# Altium schematic sheet 08_Fan Debug and EEPROM.SchDoc: C200
size 439 x 311 mm; Page Create Date: March  8, 1995; Page Number: 8; Page Size: Custom; Comment: radxa_1010; Page Count: 21; RevCode: V1.11; Doc: 08_Fan Debug and EEPROM; DsnPath: D:\WMS\C200\CC122\对外\C200 V1.11.DSN; SchematicName: c200; PageName: 08_Fan Debug and EEPROM; PageSize: Custom; TopSchematic: True
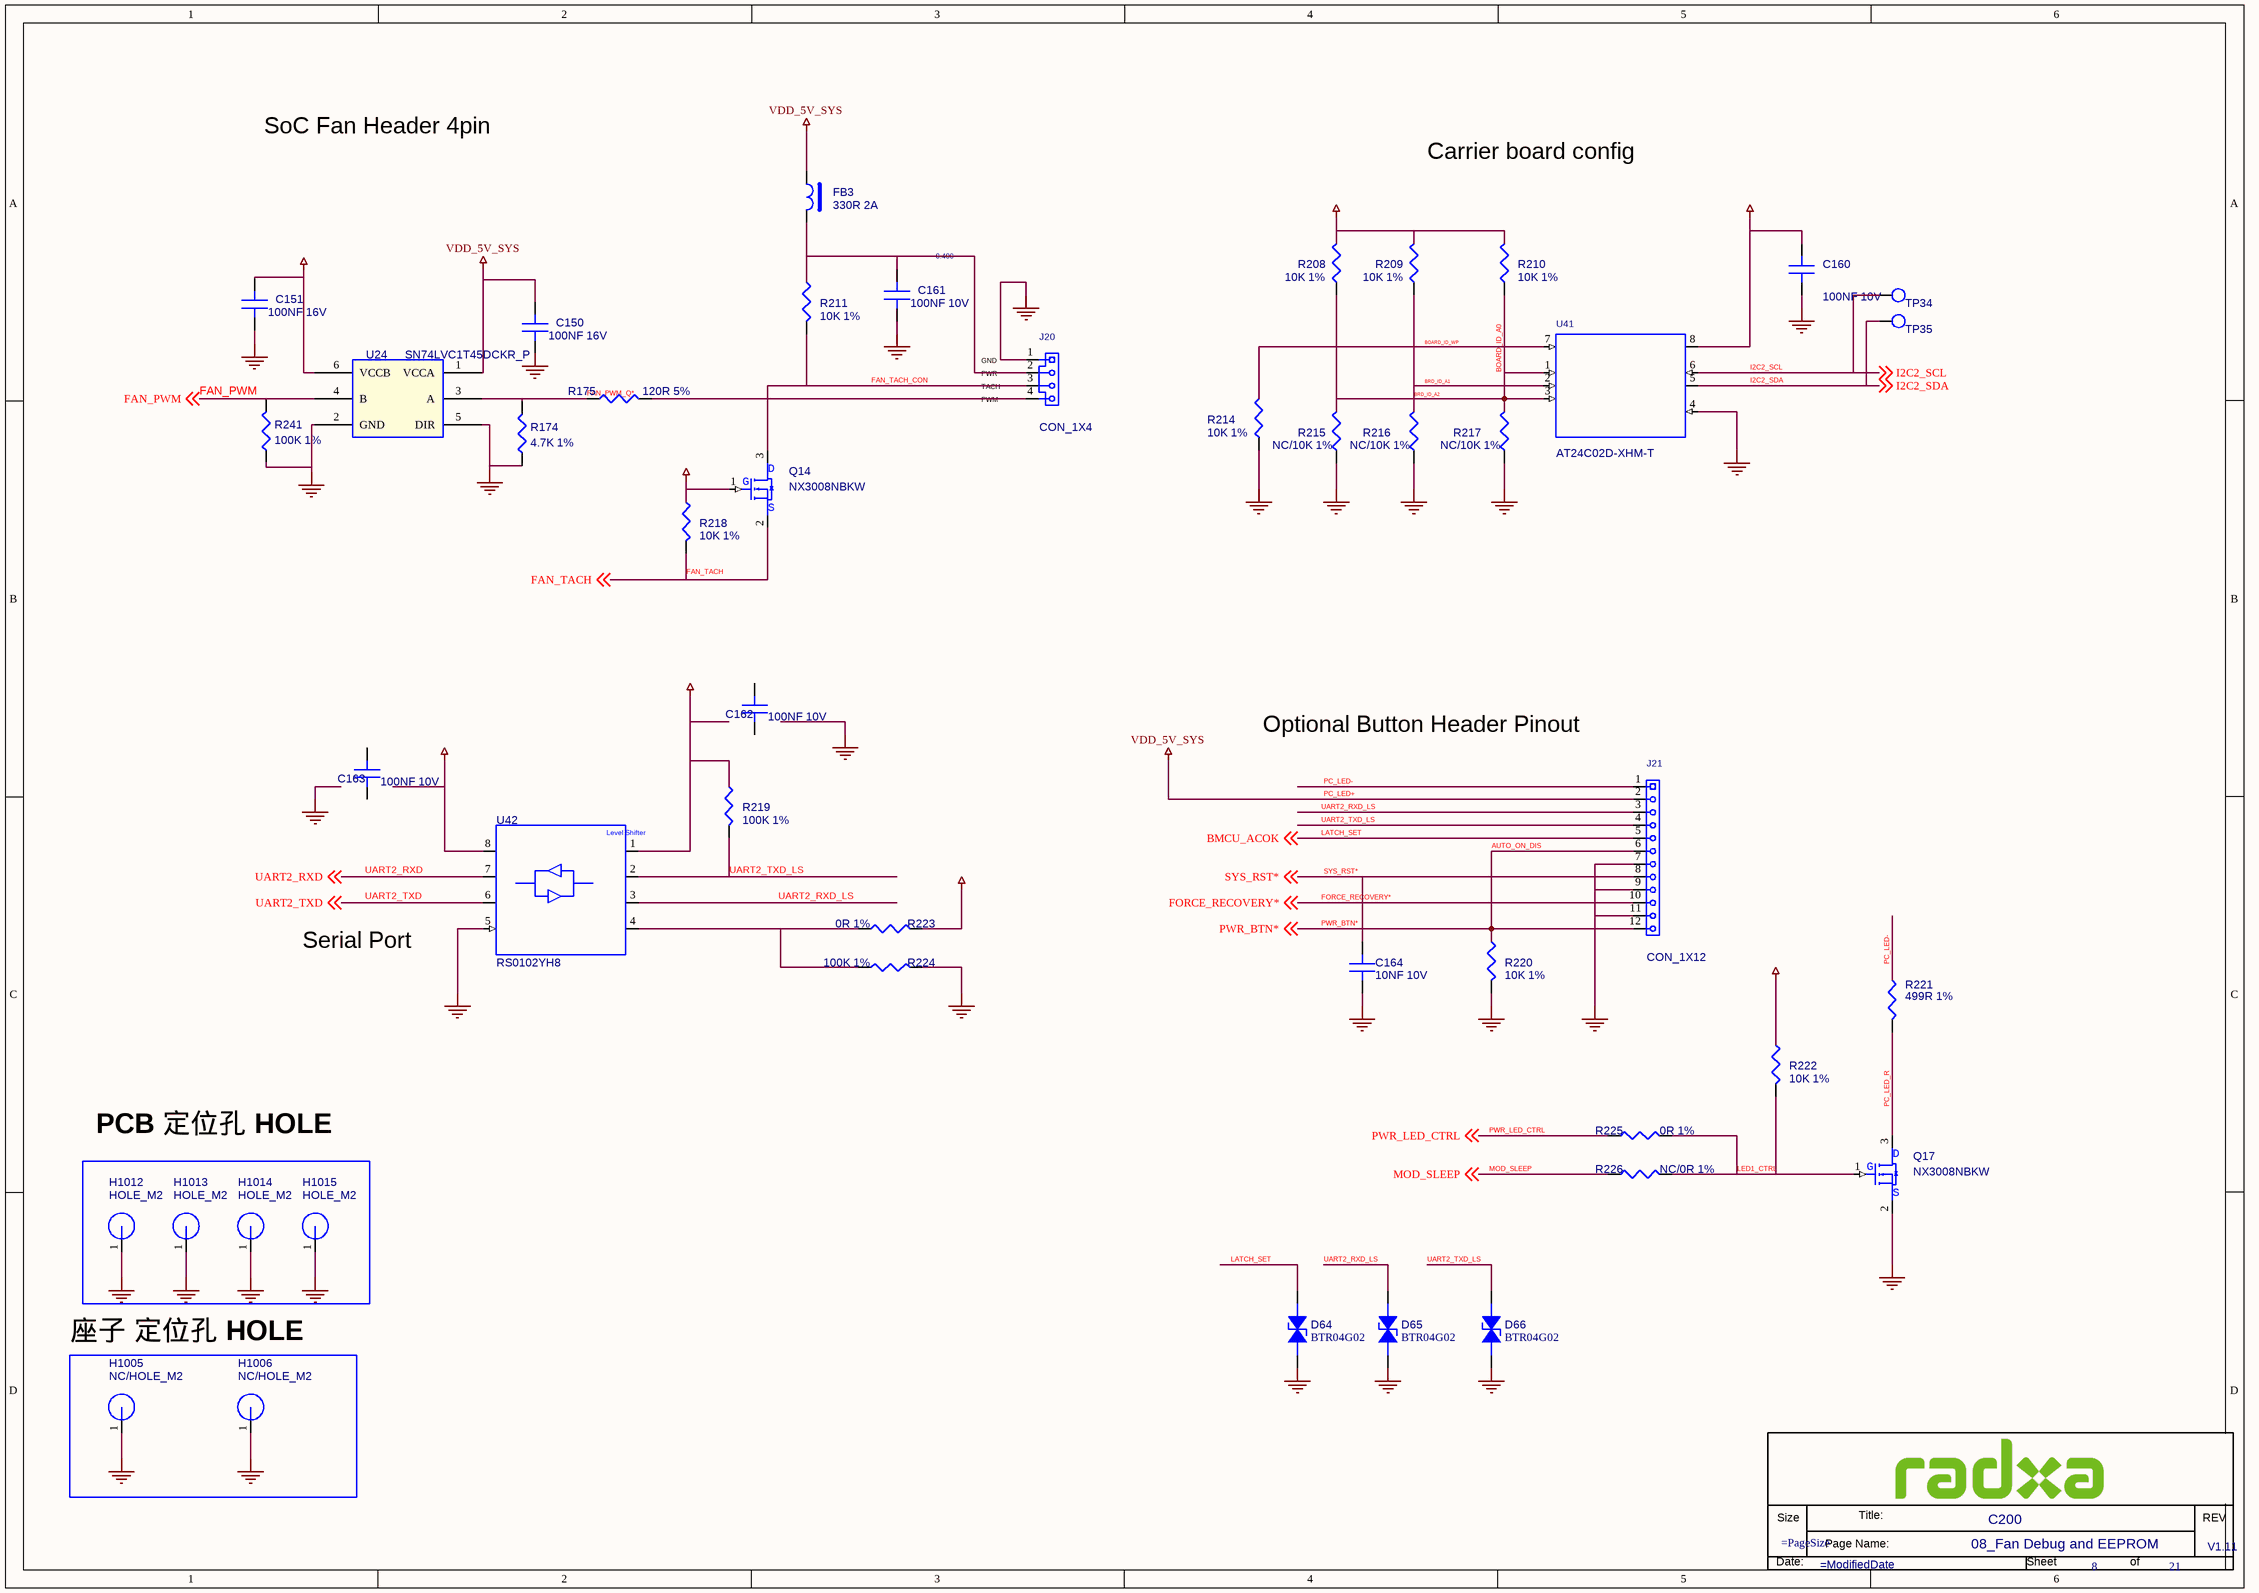
[diagram p0: 08_Fan Debug and EEPROM.SchDoc]

## Parts
*  Doc: 08_Fan Debug and EEPROM  RevCode: V1.11  Title: C200  Page Number: 8  Page Count: 21  (hidden comment: radxa_1010)  (graphical)
C150  100NF 16V  [C0201]
C151  100NF 16V  [C0201]
C160  100NF 10V  [C0402]
C161  100NF 10V  [C0402]
C162  100NF 10V  [C0402]
C163  100NF 10V  [C0402]
C164  10NF 10V  [C0201]
D64  BTR04G02  [DFN1006-2L]
D65  BTR04G02  [DFN1006-2L]
D66  BTR04G02  [DFN1006-2L]
FB3  330R 2A  [FB0603]
H1005  NC/HOLE_M2  [H3.8MM]
H1006  NC/HOLE_M2  [H3.8MM]
H1012  HOLE_M2  [H3.8MM]
H1013  HOLE_M2  [H3.8MM]
H1014  HOLE_M2  [H3.8MM]
H1015  HOLE_M2  [H3.8MM]
J20  CON_1X4  [CON_TH1X4_1D25_STA]
J21  CON_1X12  [CON_TH12X1_2D54_LIE]
Q14  NX3008NBKW  [SOT_323]
Q17  NX3008NBKW  [SOT_323]
R174  4.7K 1%  [R0402]
R175  120R 5%  [R0402]
R208  10K 1%  [R0402]
R209  10K 1%  [R0402]
R210  10K 1%  [R0402]
R211  10K 1%  [R0402]
R214  10K 1%  [R0402]
R215  NC/10K 1%  [R0402]
R216  NC/10K 1%  [R0402]
R217  NC/10K 1%  [R0402]
R218  10K 1%  [R0402]
R219  100K 1%  [R0402]
R220  10K 1%  [R0402]
R221  499R 1%  [R0402]
R222  10K 1%  [R0402]
R223  0R 1%  [R0402]
R224  100K 1%  [R0402]
R225  0R 1%  [R0402]
R226  NC/0R 1%  [R0402]
R241  100K 1%  [R0402]
TP34  DNI  [stp30]  (value not drawn)
TP35  DNI  [stp30]  (value not drawn)
U24  SN74LVC1T45DCKR_P  [SOT_363]
U41  AT24C02D-XHM-T  [DFN8_0D5_1D6]
U42  RS0102YH8  [SOT23_8]

## Blocks framed on the sheet
座子 定位孔 HOLE: H1005 H1006

## Nets
GND: C150.2(B) C151.2(B) C160.2(B) C161.2(B) C164.2(B) D64.1(ANODE) D65.1(ANODE) D66.1(ANODE) H1005.1 H1006.1 H1012.1 H1013.1 H1014.1 H1015.1 J20.1 J21.7 J21.9 J21.11 Q17.2(S) R174.1 R214.2 R215.2 R216.2 R217.2 R220.2 R224.1 R241.1 U24.2(GND) U24.5(DIR) U41.4(GND) U42.5(GND)
PC_LED+: C150.1(A) FB3.1 J21.2 U24.1(VCCA)  [also labelled VDD_5V_SYS]
VDD_1V8: C151.1(A) C160.1(A) Q14.1(G) R208.1 R209.1 R210.1 R218.1 R222.1 R223.1 U24.6(VCCB) U41.8(VCC) U42.8(VCCA)
VDD_3V3_SYS: R219.1 U42.1(VCCB)
AUTO_ON_DIS: J21.6 J21.12 R220.1 ; off-sheet PWR_BTN*  [also labelled PWR_BTN*]
BOARD_ID_A0: R208.2 R209.2 R210.2 R215.1 R216.1 R217.1 U41.1(A0) U41.2(A1) U41.3(A2)  [also labelled BRD_ID_A1, BRD_ID_A2]
BOARD_ID_WP: R214.1 U41.7(WP)
FAN_PWM: R241.2 U24.4(B) ; off-sheet FAN_PWM
FAN_PWM_Q*: R174.2 R175.1 U24.3(A)
FAN_TACH: Q14.2(S) R218.2 ; off-sheet FAN_TACH
FAN_TACH_CON: J20.3 Q14.3(D) R211.2
FORCE_RECOVERY*: J21.10 ; off-sheet FORCE_RECOVERY*
I2C2_SCL: TP34.1 U41.6(SCL) ; off-sheet I2C2_SCL
I2C2_SDA: TP35.1 U41.5(SDA) ; off-sheet I2C2_SDA
LATCH_SET: D64.2(CATHODE) J21.5 ; off-sheet BMCU_ACOK  [also labelled BMCU_ACOK]
LED1_CTRL: Q17.1(G) R222.2 R225.2 R226.2
MOD_SLEEP: R226.1 ; off-sheet MOD_SLEEP
PC_LED-: J21.1 R221.1
PC_LED_R: Q17.3(D) R221.2
PWR_LED_CTRL: R225.1 ; off-sheet PWR_LED_CTRL
SYS_RST*: C164.1(A) J21.8 ; off-sheet SYS_RST*
UART2_RXD: U42.7(A1) ; off-sheet UART2_RXD
UART2_RXD_LS: D65.2(CATHODE) J21.3 U42.3(B2)
UART2_TXD: U42.6(A2) ; off-sheet UART2_TXD
UART2_TXD_LS: D66.2(CATHODE) J21.4 R219.2 U42.2(B1)
NetC161_1: C161.1(A) FB3.2 J20.2 R211.1
NetJ20_4: J20.4 R175.2
NetR223_2: R223.2 R224.2 U42.4(OE)

Not connected (* = marked no-connect by the designer): C162 1(A) 2(B); C163 1(A) 2(B)

## Notes on the sheet
- SoC Fan Header 4pin
- Carrier board config
- (near C161) 0.400
- (near J20) PWR
- (near J20) GND
- (near J20) PWM
- (near J20) TACH
- Optional Button Header Pinout
- Serial Port
- PCB 定位孔 HOLE
- (in symbol radxa_1010) Size; Title:; REV; Page Name:; Date:; Sheet; of

## Library data of the parts
C150 = C: SMD  0201  100NF  16V  X5R  ±10%  ROHS; PARTS: 1; Part Reference: C150; Part Number: A1C01.00018; OriginalSymbolOrigin: (0,30); PKG_TYPE: CAP2-100-250; LEVEL: STD; PINSWAP: (A,B); Preferred: 6715f349cd0bc5; Value: 100NF 16V; Part Type: 陶瓷电容; PCB Footprint: C0201
C151 = C: SMD  0201  100NF  16V  X5R  ±10%  ROHS; PARTS: 1; Part Reference: C151; Part Number: A1C01.00018; OriginalSymbolOrigin: (0,30); PKG_TYPE: CAP2-100-250; LEVEL: STD; PINSWAP: (A,B); Preferred: 6715f349cd0bc5; Value: 100NF 16V; Part Type: 陶瓷电容; PCB Footprint: C0201
C160 = C: SMD  0402  100NF  10V  X5R  ±10%  ROHS; PARTS: 1; Part Reference: C160; Part Number: A1C01.00163; OriginalSymbolOrigin: (0,30); PKG_TYPE: CAP2-100-250; LEVEL: STD; PINSWAP: (A,B); Value: 100NF 10V; Part Type: 陶瓷电容; PCB Footprint: C0402
C161 = C: SMD  0402  100NF  10V  X5R  ±10%  ROHS; PARTS: 1; Part Reference: C161; Part Number: A1C01.00163; OriginalSymbolOrigin: (0,30); PKG_TYPE: CAP2-100-250; LEVEL: STD; PINSWAP: (A,B); Value: 100NF 10V; Part Type: 陶瓷电容; PCB Footprint: C0402
C162 = C: SMD  0402  100NF  10V  X5R  ±10%  ROHS; PARTS: 1; Part Reference: C162; CDS_PART_NAME: C_0402-0.1UF,X5R,10%,6.3V,039-0007-000; CDS_PHYS_PART_NAME: C_0402-0.1UF,X5R,10%,6.3V,039-0007-000-0.1UF,039-0007-000; Part Number: A1C01.00163; OriginalSymbolOrigin: (0,30); PKG_TYPE: CAP2-100-250; LEVEL: STD; PINSWAP: (A,B); ASSEMBLY: DEBUG; CDS_LIB: discrete; DEVICE_TYPENAME: C_0402-01UFX5R1063V039-0007-000-01UF039-0007-000; DRAWING: @P3449_B01_LIB.P3449_B01(SCH_1):PAGE20; MAX_VOLTAGE: 6.3V; NV_PN: 039-0007-000; PACK_TYPE: 402; PATH: I307; PHYS_PAGE: 20; ROT: 0; SIGNAL_MODEL: nv_cap; VER: 2; XY: (-8050,2950); Value: 100NF 10V; CDS_SEC: 1; CHIPS_PART_NAME: C; MAT: X5R; TOL: 10%; SEC: 1; Part Type: 陶瓷电容; PCB Footprint: C0402
C163 = C: SMD  0402  100NF  10V  X5R  ±10%  ROHS; PARTS: 1; Part Reference: C163; CDS_PART_NAME: C_0402-0.1UF,X5R,10%,6.3V,039-0007-000; CDS_PHYS_PART_NAME: C_0402-0.1UF,X5R,10%,6.3V,039-0007-000-0.1UF,039-0007-000; Part Number: A1C01.00163; OriginalSymbolOrigin: (0,30); PKG_TYPE: CAP2-100-250; LEVEL: STD; PINSWAP: (A,B); ASSEMBLY: DEBUG; CDS_LIB: discrete; DEVICE_TYPENAME: C_0402-01UFX5R1063V039-0007-000-01UF039-0007-000; DRAWING: @P3449_B01_LIB.P3449_B01(SCH_1):PAGE20; MAX_VOLTAGE: 6.3V; NV_PN: 039-0007-000; PACK_TYPE: 402; PATH: I309; PHYS_PAGE: 20; ROT: 0; SIGNAL_MODEL: nv_cap; VER: 2; XY: (-9550,2700); Value: 100NF 10V; CDS_SEC: 1; CHIPS_PART_NAME: C; MAT: X5R; TOL: 10%; SEC: 1; Part Type: 陶瓷电容; PCB Footprint: C0402
C164 = C: SMD  0201  10NF  10V  X5R  ±20%  ROHS; PARTS: 1; Part Reference: C164; Part Number: A1C01.00095; OriginalSymbolOrigin: (0,30); PKG_TYPE: CAP2-100-250; LEVEL: STD; PINSWAP: (A,B); Value: 10NF 10V; Part Type: 陶瓷电容; PCB Footprint: C0201
D64 = ESD: SMD  编带  0402  BTR04G02  B-tron  ROHS; Part Reference: D64; Part Number: A1D02.00002; Parameter: ESD-台舟 ESD5341N-封装 esd0402; ID: DE-E0004; Temp Coeff: -50℃ ~ +125℃; PCB Footprint: ESD_D0402; Value: BTR04G02; Part Type: 二极管-ESD管-桥堆-TVS管
D65 = ESD: SMD  编带  0402  BTR04G02  B-tron  ROHS; Part Reference: D65; Part Number: A1D02.00002; Parameter: ESD-台舟 ESD5341N-封装 esd0402; ID: DE-E0004; Temp Coeff: -50℃ ~ +125℃; PCB Footprint: ESD_D0402; Value: BTR04G02; Part Type: 二极管-ESD管-桥堆-TVS管
D66 = ESD: SMD  编带  0402  BTR04G02  B-tron  ROHS; Part Reference: D66; Part Number: A1D02.00002; Parameter: ESD-台舟 ESD5341N-封装 esd0402; ID: DE-E0004; Temp Coeff: -50℃ ~ +125℃; PCB Footprint: ESD_D0402; Value: BTR04G02; Part Type: 二极管-ESD管-桥堆-TVS管
FB3 = BEAD: SMD  0603  FB330R  2A  ±25%  ROHS; Part Reference: FB3; Part Number: A1L09.00023; PCB Footprint: FB0603; Value: 330R 2A; Part Type: 贴片磁珠
H1005 = HOLE: Part Reference: H1005; PCB Footprint: HOLE_C6_0D3_5MM; RK PN: HOLE_3R50; Priority: A; Value: NC/HOLE_M2; Part Type: HOLE
H1006 = HOLE: Part Reference: H1006; PCB Footprint: HOLE_C6_0D3_5MM; RK PN: HOLE_3R50; Priority: A; Value: NC/HOLE_M2; Part Type: HOLE
H1012 = HOLE: Part Reference: H1012; PCB Footprint: HOLE_C6_2D2_75MM; Priority: A; RK PN: HOLE_3R50; Value: HOLE_M2; Part Type: HOLE
H1013 = HOLE: Part Reference: H1013; PCB Footprint: HOLE_C6_2D2_75MM; Priority: A; RK PN: HOLE_3R50; Value: HOLE_M2; Part Type: HOLE
H1014 = HOLE: Part Reference: H1014; PCB Footprint: HOLE_C6_2D2_75MM; RK PN: HOLE_3R50; Priority: A; Value: HOLE_M2; Part Type: HOLE
H1015 = HOLE: Part Reference: H1015; PCB Footprint: HOLE_C6_2D2_75MM; RK PN: HOLE_3R50; Priority: A; Value: HOLE_M2; Part Type: HOLE
J20 = CON_1X4: DIP  母座  1*4PIN  90度  直脚  1.25mm脚距  5001-WF0125C-04P1-00  白色   文章济美  ROHS; Part Reference: J20; Part Number: A1J01.00077; OriginalSymbolOrigin: (-50,50); ANGLE: ?; ASSEMBLY: ?; GENDER: ?; LATCHING: ?; MAX_CURRENT: ?; MAX_VOLTAGE: ?; NV_NAME: ?; NV_PN: ?; PACK_TYPE: ?; PATH: ?; PITCH: ?; PLACEMENT_NOTE: ?; REFLOW: ?; SHROUDED: ?; SKU: COMMON; Value: CON_1X4; Part Type: 连接座; PCB Footprint: CON_TH1X4_1D25_STA
J21 = CON_1X12: DIP  排针座  1*12PIN  90度  弯角  2.54mm脚距  L=13.8/3.0(1.2)/6.0  PA6T  国意英  ROHS; Part Reference: J21; Part Number: A1J02.00035; OriginalSymbolOrigin: (0,300); ANGLE: ?; ASSEMBLY: ?; GENDER: ?; LATCHING: ?; MAX_CURRENT: ?; MAX_VOLTAGE: ?; NV_NAME: ?; NV_PN: ?; PACK_TYPE: ?; PATH: ?; PITCH: ?; PLACEMENT_NOTE: ?; REFLOW: ?; SHROUDED: ?; SKU: COMMON; Value: CON_1X12; Part Type: 排座; PCB Footprint: CON_TH12X1_2D54_LIE
Q14 = MOSFET_NPN: SMD  编带  SOT-323  NX3008NBKW  N沟道  Nexperia(安世)  ROHS; Part Reference: Q14; Part Number: A1D01.00070; Temp Coeff: -55℃ to ＋150℃; Value: NX3008NBKW; Part Type: 三极管-MOS管; PCB Footprint: SOT_323
Q17 = MOSFET_NPN: SMD  编带  SOT-323  NX3008NBKW  N沟道  Nexperia(安世)  ROHS; Part Reference: Q17; Part Number: A1D01.00070; Temp Coeff: -55℃ to ＋150℃; Value: NX3008NBKW; Part Type: 三极管-MOS管; PCB Footprint: SOT_323
R174 = R: SMD  0201  4.7K  1/20W  ±1%  ROHS; Part Reference: R174; Part Number: A1R01.00148; PCB Footprint: R0201; Preferred: 6715f349cd0bc5; Value: 4.7K 1%; Part Type: 贴片电阻
R175 = R: SMD  0402  120R  1/16W  ±5%  ROHS; Part Reference: R175; Part Number: A1R01.00275; Preferred: 6715f349cd0bc5; PCB Footprint: R0402; Value: 120R 5%; Part Type: 贴片电阻
R208 = R: SMD  0402  10K  1/16W  ±1%  ROHS; Part Reference: R208; CDS_PART_NAME: R_0402-10K,5 %,62.5MW,195-0486-000; CDS_PHYS_PART_NAME: R_0402-10K,5 %,62.5MW,195-0486-000-10K,195-0486-000; Part Number: A1R01.00222; ASSEMBLY: L4T_EEPROM; CDS_LIB: discrete; CDS_SEC: 1; DEVICE_TYPENAME: R_0402-10K5625MW195-0486-000-10K195-0486-000; DRAWING: @P3449_B01_LIB.P3449_B01(SCH_1):PAGE20; MAX_WATTAGE: 62.5mW; NV_PN: 195-0486-000; PACK_TYPE: 402; PATH: I346; PHYS_PAGE: 20; ROT: 2; SIGNAL_MODEL: nv_res; TOL: 5%; XY: (-4100,6200); PCB Footprint: R0402; Value: 10K 1%; CHIPS_PART_NAME: R; SEC_TYPE: 402; VER: 2; SEC: 1; Part Type: 贴片电阻
R209 = R: SMD  0402  10K  1/16W  ±1%  ROHS; Part Reference: R209; CDS_PART_NAME: R_0402-10K,5 %,62.5MW,195-0486-000; CDS_PHYS_PART_NAME: R_0402-10K,5 %,62.5MW,195-0486-000-10K,195-0486-000; Part Number: A1R01.00222; ASSEMBLY: L4T_EEPROM; CDS_LIB: discrete; CDS_SEC: 1; DEVICE_TYPENAME: R_0402-10K5625MW195-0486-000-10K195-0486-000; DRAWING: @P3449_B01_LIB.P3449_B01(SCH_1):PAGE20; MAX_WATTAGE: 62.5mW; NV_PN: 195-0486-000; PACK_TYPE: 402; PATH: I344; PHYS_PAGE: 20; ROT: 2; SIGNAL_MODEL: nv_res; TOL: 5%; XY: (-3800,6200); PCB Footprint: R0402; Value: 10K 1%; CHIPS_PART_NAME: R; SEC_TYPE: 402; VER: 2; SEC: 1; Part Type: 贴片电阻
R210 = R: SMD  0402  10K  1/16W  ±1%  ROHS; Part Reference: R210; Part Number: A1R01.00222; CDS_PHYS_PART_NAME: R_0402-10K,5 %,62.5MW,195-0486-000-10K,195-0486-000; CDS_PART_NAME: R_0402-10K,5 %,62.5MW,195-0486-000; SEC: 1; XY: (-3450,6200); VER: 2; TOL: 5%; SIGNAL_MODEL: nv_res; SEC_TYPE: 402; PHYS_PAGE: 20; PATH: I343; NV_PN: 195-0486-000; MAX_WATTAGE: 62.5mW; DRAWING: @P3449_B01_LIB.P3449_B01(SCH_1):PAGE20; DEVICE_TYPENAME: R_0402-10K5625MW195-0486-000-10K195-0486-000; CDS_LIB: discrete; ASSEMBLY: L4T_EEPROM; PCB Footprint: R0402; Value: 10K 1%; Part Type: 贴片电阻; ROT: 2; PACK_TYPE: 402; CHIPS_PART_NAME: R; CDS_SEC: 1
R211 = R: SMD  0402  10K  1/16W  ±1%  ROHS; Part Reference: R211; CDS_PART_NAME: R_0402-10K,5 %,62.5MW,195-0486-000; CDS_PHYS_PART_NAME: R_0402-10K,5 %,62.5MW,195-0486-000-10K,195-0486-000; Part Number: A1R01.00222; ASSEMBLY: FAN; CDS_LIB: discrete; CDS_SEC: 1; DEVICE_TYPENAME: R_0402-10K5625MW195-0486-000-10K195-0486-000; DRAWING: @P3449_B01_LIB.P3449_B01(SCH_1):PAGE20; MAX_WATTAGE: 62.5mW; NV_PN: 195-0486-000; PACK_TYPE: 402; PATH: I372; PHYS_PAGE: 20; ROT: 0; SIGNAL_MODEL: nv_res; TOL: 5%; VER: 2; XY: (-8350,5950); PCB Footprint: R0402; Value: 10K 1%; CHIPS_PART_NAME: R; SEC: 1; Part Type: 贴片电阻
R214 = R: SMD  0402  10K  1/16W  ±1%  ROHS; Part Reference: R214; CDS_PART_NAME: R_0402-10K,5 %,62.5MW,195-0486-000; CDS_PHYS_PART_NAME: R_0402-10K,5 %,62.5MW,195-0486-000-10K,195-0486-000; Part Number: A1R01.00222; ASSEMBLY: L4T_EEPROM; CDS_LIB: discrete; CDS_SEC: 1; DEVICE_TYPENAME: R_0402-10K5625MW195-0486-000-10K195-0486-000; DRAWING: @P3449_B01_LIB.P3449_B01(SCH_1):PAGE20; MAX_WATTAGE: 62.5mW; NV_PN: 195-0486-000; PACK_TYPE: 402; PATH: I350; PHYS_PAGE: 20; ROT: 2; SIGNAL_MODEL: nv_res; TOL: 5%; XY: (-4400,5600); PCB Footprint: R0402; Value: 10K 1%; CHIPS_PART_NAME: R; SEC_TYPE: 402; VER: 2; SEC: 1; Part Type: 贴片电阻
R215 = R: SMD  0402  10K  1/16W  ±1%  ROHS; Part Reference: R215; Part Number: A1R01.00222; CDS_PHYS_PART_NAME: R_0402-10K,5 %,62.5MW,195-0486-000-10K,195-0486-000; CDS_PART_NAME: R_0402-10K,5 %,62.5MW,195-0486-000; SEC: 1; XY: (-4100,5550); VER: 2; TOL: 5%; SIGNAL_MODEL: nv_res; PHYS_PAGE: 20; PATH: I375; PACK_TYPE: 402; NV_PN: 195-0486-000; MAX_WATTAGE: 62.5mW; DRAWING: @P3449_B01_LIB.P3449_B01(SCH_1):PAGE20; DEVICE_TYPENAME: R_0402-10K5625MW195-0486-000-10K195-0486-000; CDS_LIB: discrete; ASSEMBLY: L4T_EEPROM; PCB Footprint: R0402; Value: NC/10K 1%; Part Type: 贴片电阻; SKU: NO STUFF; ROT: 2; CHIPS_PART_NAME: R; CDS_SEC: 1
R216 = R: SMD  0402  10K  1/16W  ±1%  ROHS; Part Reference: R216; Part Number: A1R01.00222; CDS_PHYS_PART_NAME: R_0402-10K,5 %,62.5MW,195-0486-000-10K,195-0486-000; CDS_PART_NAME: R_0402-10K,5 %,62.5MW,195-0486-000; SEC: 1; XY: (-3800,5550); VER: 2; TOL: 5%; SIGNAL_MODEL: nv_res; PHYS_PAGE: 20; PATH: I374; PACK_TYPE: 402; NV_PN: 195-0486-000; MAX_WATTAGE: 62.5mW; DRAWING: @P3449_B01_LIB.P3449_B01(SCH_1):PAGE20; DEVICE_TYPENAME: R_0402-10K5625MW195-0486-000-10K195-0486-000; CDS_LIB: discrete; ASSEMBLY: L4T_EEPROM; PCB Footprint: R0402; Value: NC/10K 1%; Part Type: 贴片电阻; SKU: NO STUFF; ROT: 2; CHIPS_PART_NAME: R; CDS_SEC: 1
R217 = R: SMD  0402  10K  1/16W  ±1%  ROHS; Part Reference: R217; Part Number: A1R01.00222; CDS_PHYS_PART_NAME: R_0402-10K,5 %,62.5MW,195-0486-000-10K,195-0486-000; CDS_PART_NAME: R_0402-10K,5 %,62.5MW,195-0486-000; SEC: 1; XY: (-3450,5550); VER: 2; TOL: 5%; SIGNAL_MODEL: nv_res; SEC_TYPE: 402; PHYS_PAGE: 20; PATH: I348; NV_PN: 195-0486-000; MAX_WATTAGE: 62.5mW; DRAWING: @P3449_B01_LIB.P3449_B01(SCH_1):PAGE20; DEVICE_TYPENAME: R_0402-10K5625MW195-0486-000-10K195-0486-000; CDS_LIB: discrete; ASSEMBLY: L4T_EEPROM; PCB Footprint: R0402; Value: NC/10K 1%; Part Type: 贴片电阻; SKU: NO STUFF; ROT: 2; PACK_TYPE: 402; CHIPS_PART_NAME: R; CDS_SEC: 1
R218 = R: SMD  0402  10K  1/16W  ±1%  ROHS; Part Reference: R218; Part Number: A1R01.00222; CDS_PHYS_PART_NAME: R_0402-10K,5 %,62.5MW,195-0486-000-10K,195-0486-000; CDS_PART_NAME: R_0402-10K,5 %,62.5MW,195-0486-000; SEC: 1; XY: (-9150,4600); VER: 2; TOL: 5%; SIGNAL_MODEL: nv_res; ROT: 0; PHYS_PAGE: 20; PATH: I370; PACK_TYPE: 402; NV_PN: 195-0486-000; MAX_WATTAGE: 62.5mW; DRAWING: @P3449_B01_LIB.P3449_B01(SCH_1):PAGE20; DEVICE_TYPENAME: R_0402-10K5625MW195-0486-000-10K195-0486-000; CDS_LIB: discrete; ASSEMBLY: FAN; PCB Footprint: R0402; Value: 10K 1%; Part Type: 贴片电阻; CHIPS_PART_NAME: R; CDS_SEC: 1
R219 = R: SMD  0402  100K  1/16W  ±1%  ROHS; Part Reference: R219; Part Number: A1R01.00031; CDS_PHYS_PART_NAME: R_0402-100K,1 %,62.5MW,195-0005-000-100K,195-0005-000; CDS_PART_NAME: R_0402-100K,1 %,62.5MW,195-0005-000; Temp Coeff: －55℃ ~ ＋155℃; SEC: 1; XY: (-8150,2600); VER: 2; SIGNAL_MODEL: nv_res; ROT: 0; PHYS_PAGE: 20; PATH: I367; PACK_TYPE: 402; NV_PN: 195-0005-000; MAX_WATTAGE: 62.5mW; DRAWING: @P3449_B01_LIB.P3449_B01(SCH_1):PAGE20; DEVICE_TYPENAME: R_0402-100K1625MW195-0005-000-100K195-0005-000; CDS_LIB: discrete; ASSEMBLY: DEBUG; PCB Footprint: R0402; Value: 100K 1%; Part Type: 贴片电阻; TOL: 1%; CHIPS_PART_NAME: R; CDS_SEC: 1
R220 = R: SMD  0402  10K  1/16W  ±1%  ROHS; Part Reference: R220; Part Number: A1R01.00222; CDS_PART_NAME: R_0402-10K,5 %,62.5MW,195-0486-000; CDS_PHYS_PART_NAME: R_0402-10K,5 %,62.5MW,195-0486-000-10K,195-0486-000; ASSEMBLY: AUTOMATION; CDS_LIB: discrete; CDS_SEC: 1; DEVICE_TYPENAME: R_0402-10K5625MW195-0486-000-10K195-0486-000; DRAWING: #NAME?; MAX_WATTAGE: 62.5mW; NV_PN: 195-0486-000; PACK_TYPE: 402; PATH: I97; PHYS_PAGE: 23; ROT: 0; SIGNAL_MODEL: nv_res; TOL: 5%; VER: 2; XY: (-3000,2800); PCB Footprint: R0402; Value: 10K 1%; Part Type: 贴片电阻; CHIPS_PART_NAME: R; SEC: 1
R221 = R: SMD  0402  499R  1/16W  ±1%  ROHS; Part Reference: R221; Part Number: A1R01.00308; CDS_PART_NAME: R_0402-499OHM,1 %,62.5MW,195-0338-000; CDS_PHYS_PART_NAME: R_0402-499OHM,1 %,62.5MW,195-0338-000-195-0338-000,499OHM; ASSEMBLY: AUTOMATION; CDS_LIB: discrete; CDS_SEC: 1; DEVICE_TYPENAME: R_0402-499OHM1625MW195-0338-000-195-0338-000499OHM; DRAWING: @P3449_B01_LIB.P3449_B01(SCH_1):PAGE20; MAX_WATTAGE: 62.5mW; NV_PN: 195-0338-000; PACK_TYPE: 402; PATH: I420; PHYS_PAGE: 20; ROT: 0; SIGNAL_MODEL: nv_res; VER: 2; XY: (-1150,2750); PCB Footprint: R0402; Value: 499R 1%; Part Type: 贴片电阻; CHIPS_PART_NAME: R; TOL: 1%; SEC: 1
R222 = R: SMD  0402  10K  1/16W  ±1%  ROHS; Part Reference: R222; Part Number: A1R01.00222; CDS_PART_NAME: R_0402-10K,5 %,62.5MW,195-0486-000; CDS_PHYS_PART_NAME: R_0402-10K,5 %,62.5MW,195-0486-000-10K,195-0486-000; ASSEMBLY: AUTOMATION; CDS_LIB: discrete; CDS_SEC: 1; DEVICE_TYPENAME: R_0402-10K5625MW195-0486-000-10K195-0486-000; DRAWING: @P3449_B01_LIB.P3449_B01(SCH_1):PAGE20; MAX_WATTAGE: 62.5mW; NV_PN: 195-0486-000; PACK_TYPE: 402; PATH: I430; PHYS_PAGE: 20; ROT: 0; SIGNAL_MODEL: nv_res; TOL: 5%; VER: 2; XY: (-1600,2500); PCB Footprint: R0402; Value: 10K 1%; Part Type: 贴片电阻; CHIPS_PART_NAME: R; SEC: 1
R223 = R: SMD  0402  0R  1/16W  ±1%  ROHS; Part Reference: R223; Part Number: A1R01.00219; PCB Footprint: R0402; Value: 0R 1%; Part Type: 贴片电阻
R224 = R: SMD  0402  100K  1/16W  ±1%  ROHS; Part Reference: R224; Part Number: A1R01.00031; Temp Coeff: －55℃ ~ ＋155℃; PCB Footprint: R0402; Value: 100K 1%; Part Type: 贴片电阻
R225 = R: SMD  0402  0R  1/16W  ±1%  ROHS; Part Reference: R225; Part Number: A1R01.00219; PCB Footprint: R0402; Value: 0R 1%; Part Type: 贴片电阻
R226 = R: SMD  0402  0R  1/16W  ±1%  ROHS; Part Reference: R226; Part Number: A1R01.00219; PCB Footprint: R0402; Value: NC/0R 1%; Part Type: 贴片电阻
R241 = R: SMD  0201  100K  1/20W  ±1%  ROHS; Part Reference: R241; Part Number: A1R01.00165; PCB Footprint: R0201; Preferred: 6715f349cd0bc5; Value: 100K 1%; Part Type: 贴片电阻
TP34 = TP: Part Reference: TP34; partnumber: NC_00025; MFRName: NA; Parameter: 测试点; PCB Footprint: TP32; Price: 0.00000; partType: NC; MFRPN: NA; Height: 0
TP35 = TP: Part Reference: TP35; MFRPN: NA; partnumber: NC_00025; Parameter: 测试点; PCB Footprint: TP32; Height: 0; MFRName: NA; partType: NC; Price: 0.00000
U24 = SN74LVC1T45DCKR_P: SMD  电平转换  SN74LVC1T45DCKR-P  SOT363  TI(德州仪器)  ROHS; Part Reference: U24; Part Number: A1I01.00003; Preferred: 6715f349cd0bc5; Temp Coeff: -40℃ to +85℃; Value: SN74LVC1T45DCKR_P; Part Type: 集成电路/模块; PCB Footprint: SOT_363
U41 = BL34C04A_NTRC: SMD  EEPROM  AT24C02D-XHM-T美)  ROHS; Part Reference: U41; Part Number: A1I01.00594; OriginalSymbolOrigin: (-250,200); PCB Footprint: TSSOP8_0D65_4; SPEED_GRADE: ?; SKU: COMMON; POW: ?; PLACEMENT_NOTE: ?; PATH: ?; PACK_TYPE: ?; NV_PN: ?; NV_NAME: ?; ASSEMBLY: ?; Value: AT24C02D-XHM-T; Part Type: 集成电路/模块
U42 = RS0102YH8: SMD  电平转换  RS0102YH8  SOT23-8  润石  ROHS; Part Reference: U42; CHIPS_PART_NAME: U_LEVSHFT_TXB0302; CDS_PHYS_PART_NAME: U_LEVSHFT_TXB0302_DFN8-TXB0302DQMR,LEVEL SHIFTER,115-2177-000-115-2177-000; CDS_PART_NAME: U_LEVSHFT_TXB0302_DFN8-TXB0302DQMR,LEVEL SHIFTER,115-2177-000; Part Number: A1I01.00231; ASSEMBLY: DEBUG; FUNCTION: Level Shifter; NV_NAME: UM3202Q; NV_PN: 115-2177-000; PACK_TYPE: DFN8; PATH: I365; OriginalSymbolOrigin: (-250,250); SEC: 1; XY: (-8800,2300); ROT: 0; PHYS_PAGE: 20; DRAWING: @P3449_B01_LIB.P3449_B01(SCH_1):PAGE20; DEVICE_TYPENAME: U_LEVSHFT_TXB0302_DFN8-TXB0302DQMRLEVELSHIFTER115-2177-000-115-2177-000; CDS_LIB: logic; PLACEMENT_NOTE: ?; SKU: COMMON; Value: RS0102YH8; VER: 1; CDS_SEC: 1; Part Type: 集成电路/模块; PCB Footprint: SOT23_8
* = radxa_1010: Page Create Date: March  8, 1995; Page Size: =PageSize; Page Modify Date: =ModifiedDate